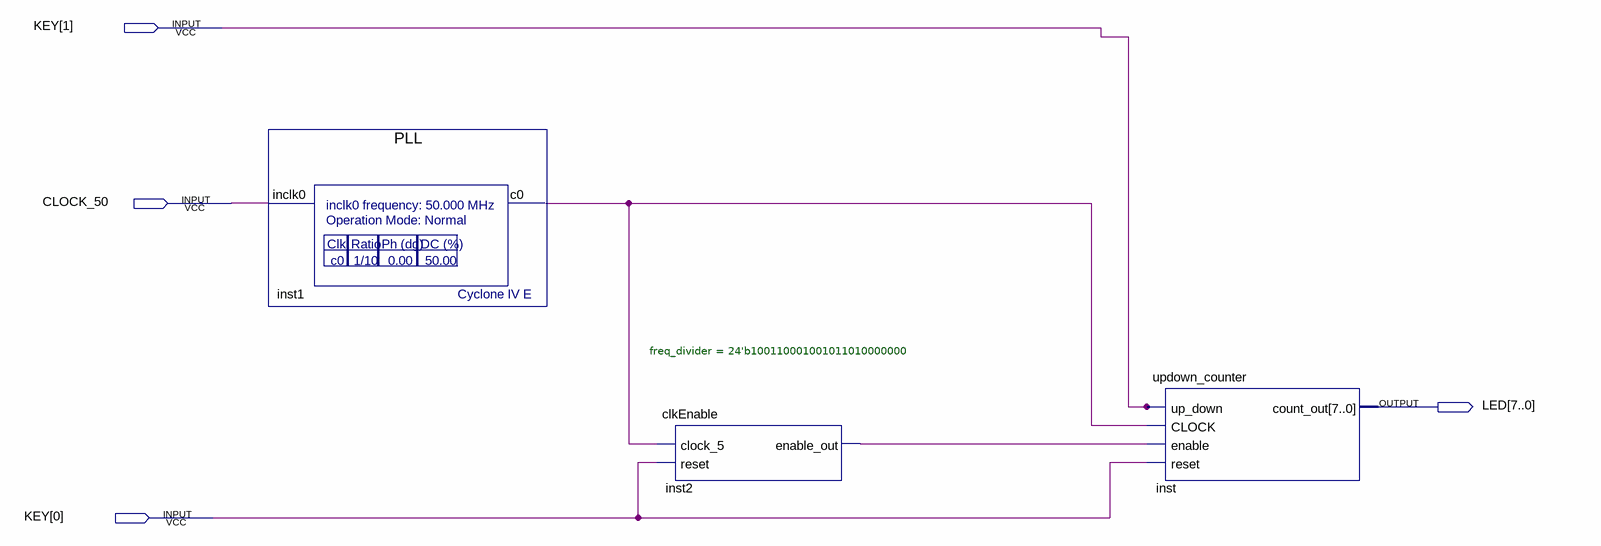
[diagram p0: schematic sheet]
// Quartus schematic 8_bit_updown_counter_unmodified.bdf as structural Verilog: 3 symbols, 4 pins
module \8_bit_updown_counter_unmodified  (
  input  [1:0] KEY,
  input  CLOCK_50,
  output [7:0] LED
);

  wire inst1_c0, inst2_enable_out;

  PLL inst1 (.inclk0(CLOCK_50), .c0(inst1_c0));
  clkEnable #(.freq_divider(24'b100110001001011010000000)) inst2 (
    .clock_5(inst1_c0), .reset(KEY[0]), .enable_out(inst2_enable_out));
  updown_counter inst (.up_down(KEY[1]), .CLOCK(inst1_c0), .enable(inst2_enable_out), .reset(KEY[0]), .count_out(LED));
endmodule
